# Altium schematic sheet CCP_Power_IO.SchDoc
size A
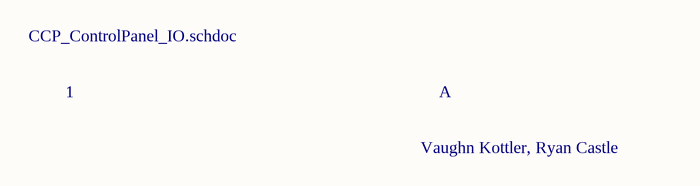
[diagram p0: CCP_Power_IO.SchDoc]

## Notes on the sheet
- CCP_ControlPanel_IO.schdoc
- 1
- A
- Vaughn Kottler, Ryan Castle